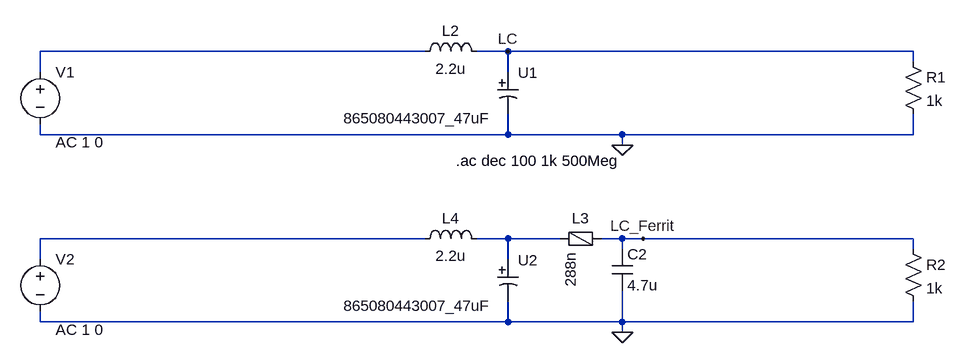
[diagram p0: schematic Eingangsfilter.asc]
Eingangsfilter.asc, the LTspice schematic file:
Version 4
SHEET 1 1620 1536
WIRE -160 144 -752 144
WIRE -32 144 -80 144
WIRE 592 144 -32 144
WIRE 592 160 592 144
WIRE -752 176 -752 144
WIRE -32 176 -32 144
WIRE -752 272 -752 256
WIRE -32 272 -32 240
WIRE -32 272 -752 272
WIRE 144 272 -32 272
WIRE 592 272 592 240
WIRE 592 272 144 272
WIRE 144 288 144 272
WIRE -160 432 -752 432
WIRE -32 432 -80 432
WIRE 48 432 -32 432
WIRE 144 432 112 432
WIRE 176 432 144 432
WIRE 592 432 176 432
WIRE 144 448 144 432
WIRE 592 448 592 432
WIRE -752 464 -752 432
WIRE -32 464 -32 432
WIRE -752 560 -752 544
WIRE -32 560 -32 528
WIRE -32 560 -752 560
WIRE 144 560 144 512
WIRE 144 560 -32 560
WIRE 592 560 592 528
WIRE 592 560 144 560
WIRE 144 576 144 560
FLAG 144 288 0
FLAG 144 576 0
FLAG -32 144 LC
FLAG 176 432 LC_Ferrit
SYMBOL res 576 144 R0
SYMATTR InstName R1
SYMATTR Value 1k
SYMBOL voltage -752 160 R0
WINDOW 123 24 124 Left 2
WINDOW 39 0 0 Left 0
SYMATTR Value2 AC 1 0
SYMATTR InstName V1
SYMATTR Value ""
SYMBOL ind -176 160 R270
WINDOW 0 32 56 VTop 2
WINDOW 3 5 56 VBottom 2
SYMATTR InstName L2
SYMATTR Value 2.2u
SYMATTR SpiceLine Ipk=7.5 Rser=0.0237 Rpar=3200 Cpar=15p mfg="Würth Elektronik" pn="74438367022 WE-MAPI 5030"
SYMBOL WCAP-ASLI 0 176 R0
WINDOW 38 -285 71 Left 2
SYMATTR SpiceModel 865080443007_47uF
SYMATTR InstName U1
SYMBOL FerriteBead 80 432 R90
WINDOW 0 -16 0 VBottom 2
SYMATTR InstName L3
SYMATTR Value 288n
SYMATTR SpiceLine Ipk=7 Rser=0.0033 Rpar=152 Cpar=78f mfg="Würth Elektronik" pn="74279224101 WE-MPSB 2220"
SYMBOL cap 128 448 R0
SYMATTR InstName C2
SYMATTR Value 4.7u
SYMATTR SpiceLine V=50 Irms=0 Rser=0.00278837 Lser=260.341p mfg="Würth Elektronik" pn="885012209048 WCAP-CSGP 1210" type="X7R"
SYMBOL res 576 432 R0
SYMATTR InstName R2
SYMATTR Value 1k
SYMBOL voltage -752 448 R0
WINDOW 123 24 124 Left 2
WINDOW 39 0 0 Left 0
SYMATTR Value2 AC 1 0
SYMATTR InstName V2
SYMATTR Value ""
SYMBOL ind -176 448 R270
WINDOW 0 32 56 VTop 2
WINDOW 3 5 56 VBottom 2
SYMATTR InstName L4
SYMATTR Value 2.2u
SYMATTR SpiceLine Ipk=7.5 Rser=0.0237 Rpar=3200 Cpar=15p mfg="Würth Elektronik" pn="74438367022 WE-MAPI 5030"
SYMBOL WCAP-ASLI 0 464 R0
WINDOW 38 -285 71 Left 2
SYMATTR SpiceModel 865080443007_47uF
SYMATTR InstName U2
TEXT -112 312 Left 2 !.ac dec 100 1k 500Meg

The netlist it stands for:
* Eingangsfilter.asc
R1 LC 0 1k
V1 N001 0 AC 1 0
L2 N001 LC 2.2u Ipk=7.5 Rser=0.0237 Rpar=3200 Cpar=15p mfg="Würth Elektronik" pn="74438367022 WE-MAPI 5030"
XU1 LC 0 865080443007_47uF  ; pins 1 2
L3 LC_Ferrit N003 288n Ipk=7 Rser=0.0033 Rpar=152 Cpar=78f mfg="Würth Elektronik" pn="74279224101 WE-MPSB 2220"
C2 LC_Ferrit 0 4.7u V=50 Irms=0 Rser=0.00278837 Lser=260.341p mfg="Würth Elektronik" pn="885012209048 WCAP-CSGP 1210" type="X7R"
R2 LC_Ferrit 0 1k
V2 N002 0 AC 1 0
L4 N002 N003 2.2u Ipk=7.5 Rser=0.0237 Rpar=3200 Cpar=15p mfg="Würth Elektronik" pn="74438367022 WE-MAPI 5030"
XU2 N003 0 865080443007_47uF  ; pins 1 2
.ac dec 100 1k 500Meg
.lib WCAP-ASLI.lib
.backanno
.end

* Results of the author's LTspice run, read from the files saved beside the schematic
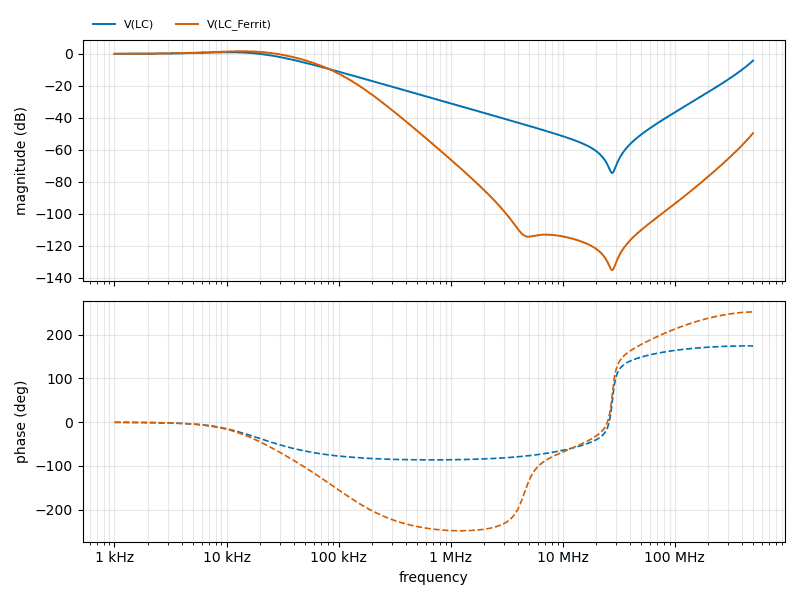
[diagram p1: AC Analysis of Eingangsfilter.asc, plotted from the saved traces]
* AC Analysis, 1 run:
*   V(LC): 0.03 dB at 1 kHz, -4.21 dB at 500 MHz, peak 1.01 dB at 10.47 kHz, 3 dB below the peak at 29.89 kHz
*   V(LC_Ferrit): 0.03 dB at 1 kHz, -49.61 dB at 500 MHz, peak 1.60 dB at 13.49 kHz, 3 dB below the peak at 35.93 kHz